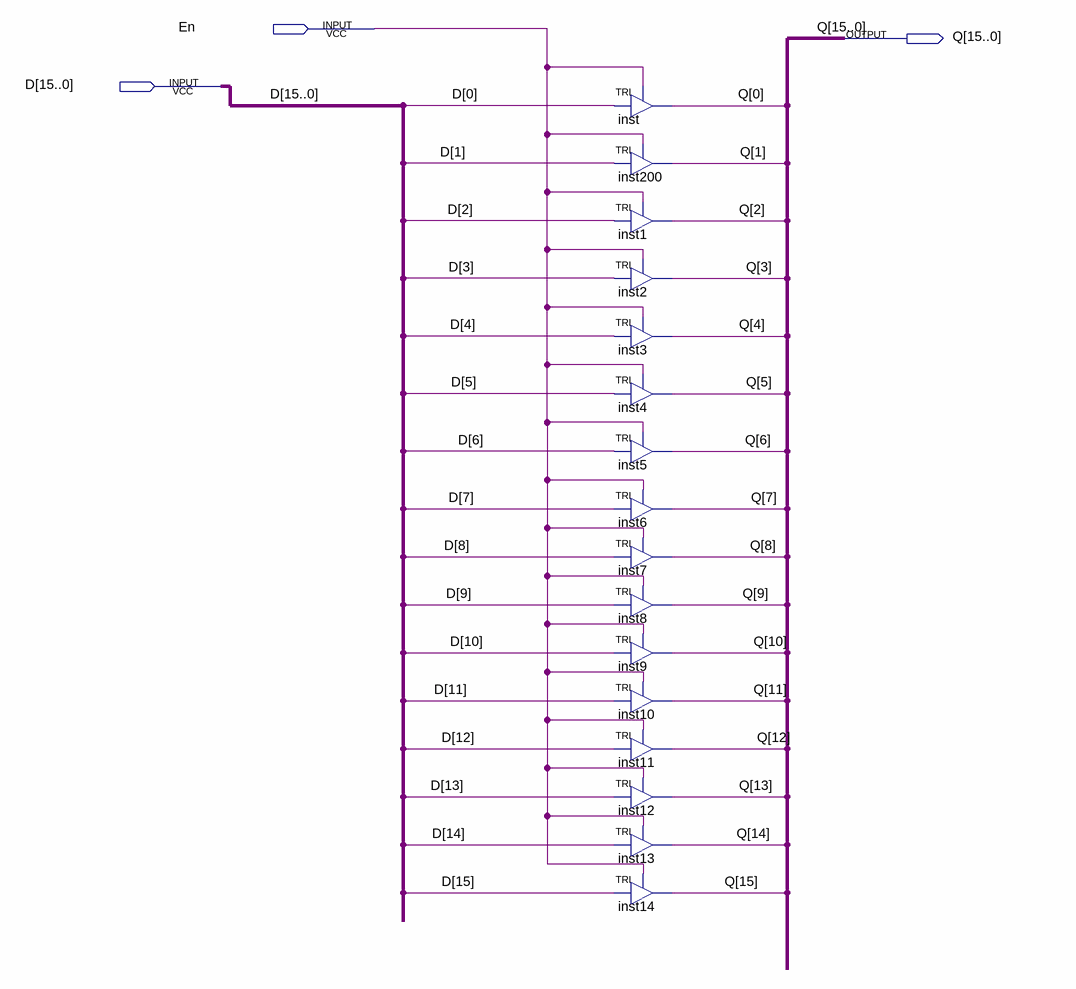
[diagram p0: schematic sheet]
// Quartus schematic 16_bit_tri.bdf as structural Verilog: 16 symbols, 3 pins
module \16_bit_tri  (
  input  En,
  input  [15:0] D,
  output [15:0] Q
);

  TRI inst (.IN(D[0]), .OE(En), .OUT(Q[0]));
  TRI inst200 (.IN(D[1]), .OE(En), .OUT(Q[1]));
  TRI inst1 (.IN(D[2]), .OE(En), .OUT(Q[2]));
  TRI inst2 (.IN(D[3]), .OE(En), .OUT(Q[3]));
  TRI inst3 (.IN(D[4]), .OE(En), .OUT(Q[4]));
  TRI inst4 (.IN(D[5]), .OE(En), .OUT(Q[5]));
  TRI inst5 (.IN(D[6]), .OE(En), .OUT(Q[6]));
  TRI inst6 (.IN(D[7]), .OE(En), .OUT(Q[7]));
  TRI inst7 (.IN(D[8]), .OE(En), .OUT(Q[8]));
  TRI inst8 (.IN(D[9]), .OE(En), .OUT(Q[9]));
  TRI inst9 (.IN(D[10]), .OE(En), .OUT(Q[10]));
  TRI inst10 (.IN(D[11]), .OE(En), .OUT(Q[11]));
  TRI inst11 (.IN(D[12]), .OE(En), .OUT(Q[12]));
  TRI inst12 (.IN(D[13]), .OE(En), .OUT(Q[13]));
  TRI inst13 (.IN(D[14]), .OE(En), .OUT(Q[14]));
  TRI inst14 (.IN(D[15]), .OE(En), .OUT(Q[15]));
endmodule
